# EAGLE design Converter_board (EAGLE 6.6.0)
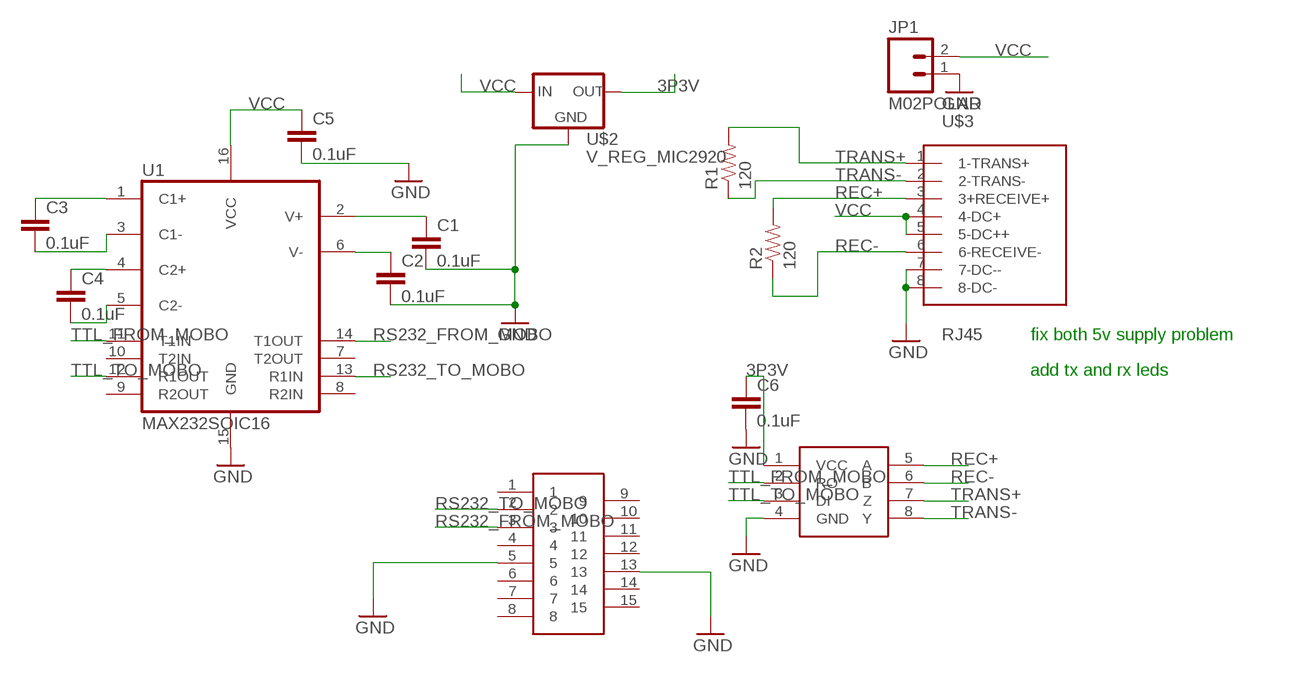
[diagram p0: schematic, sheet 1]

## Parts
C1  0.1uF  CAP1206  [1206]
C2  0.1uF  CAP1206  [1206]
C3  0.1uF  CAP1206  [1206]
C4  0.1uF  CAP1206  [1206]
C5  0.1uF  CAP1206  [1206]
C6  0.1uF  CAP1206  [1206]
JP1  M02POLAR  [MOLEX-1X2]
R1  120  RESISTOR1206  [1206]
R2  120  RESISTOR1206  [1206]
U1  MAX232SOIC16  [SO016]
U$1  MAX3077ESA  [SOIC8]
U$2  V_REG_MIC2920  [SOT223]
U$3  RJ45  [RJ45-CAT5E]
U$4  DB15  [DB15]

## Nets
3P3V: C6.1 U$1.1(VCC) U$2.3(OUT)
GND: C1.2 C2.2 C5.2 C6.2 JP1.1 U1.15(GND) U$1.4(GND) U$2.2(GND) U$3.7(7-DC--) U$3.8(8-DC-) U$4.5 U$4.13
N$1: C2.1 U1.6(V-)
N$2: C1.1 U1.2(V+)
N$3: C3.1 U1.1(C1+)
N$4: C3.2 U1.3(C1-)
N$5: C4.1 U1.4(C2+)
N$6: C4.2 U1.5(C2-)
REC+: R2.2 U$1.5(A) U$3.3(3+RECEIVE+)
REC-: R2.1 U$1.6(B) U$3.6(6-RECEIVE-)
RS232_FROM_MOBO: U1.14(T1OUT) U$4.3
RS232_TO_MOBO: U1.13(R1IN) U$4.2
TRANS+: R1.2 U$1.7(Z) U$3.1(1-TRANS+)
TRANS-: R1.1 U$1.8(Y) U$3.2(2-TRANS-)
TTL_FROM_MOBO: U1.11(T1IN) U$1.2(RO)
TTL_TO_MOBO: U1.12(R1OUT) U$1.3(DI)
VCC: C5.1 JP1.2 U1.16(VCC) U$2.1(IN) U$3.4(4-DC+) U$3.5(5-DC++)
Unconnected: U1.7(T2OUT) U1.8(R2IN) U1.9(R2OUT) U1.10(T2IN) U$4.1 U$4.4 U$4.6 U$4.7 U$4.8 U$4.9 U$4.10 U$4.11 U$4.12 U$4.14 U$4.15

## Notes on the sheet
- fix both 5v supply problem
- add tx and rx leds

## Library data of the parts
C1-C6 = SparkFun-Capacitors:CAP: Capacitor Standard 0603 ceramic capacitor, and 0.1" leaded capacitor.
JP1 = SparkFun-Connectors:M02: Standard 2-pin 0.1" header. Use with - straight break away headers ( PRT-00116) - right angle break away headers (PRT-00553) - swiss pins (PRT-00743) - machine pins (PRT-00117) - female headers (PRT-00115) Molex polarized connector foot print use with: PRT-08233 with associated crimp pins and housings. 2.54_SCREWTERM for use with PRT-10571. 3.5mm Screw Terminal footprints for PRT-08084 5mm Screw Terminal footprints for use with PRT-08433
R1 R2 = SparkFun-Passives:RESISTOR: Resistor Basic schematic elements and footprints for 0603, 1206, and PTH resistors.
U1 = SparkFun-DigitalIC:MAX232: RS232 Transceiver Very common IC. This is generically called 'MAX232', but works with the 3V equivalent MAX3232 generic ICs. Field tested and mother approved. Spark Fun Electronics SKU : COM-00316 (DIP) and COM-00589 (SMD)
U$1 = MRDT-LIB2014:MAX3077ESA
U$2 = SparkFun-PowerIC:V_REG_MIC2920: MIC2920A (http://www.micrel.com/_PDF/mic2920.pdf) - 400mA output LDO Regulator
U$3 = MRDT-LIB2014:RJ45
U$4 = MRDT-LIB2014:DB15

## Board
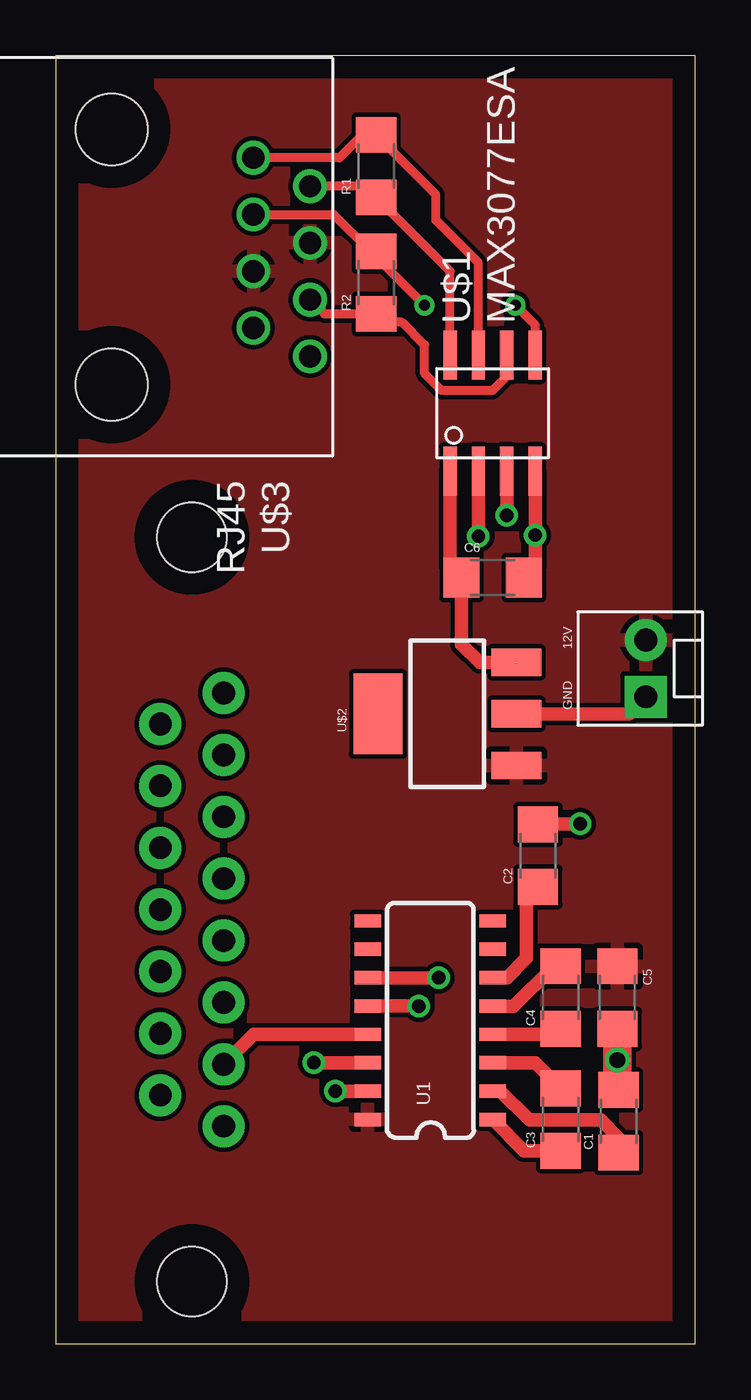
[diagram p1: board, top side]
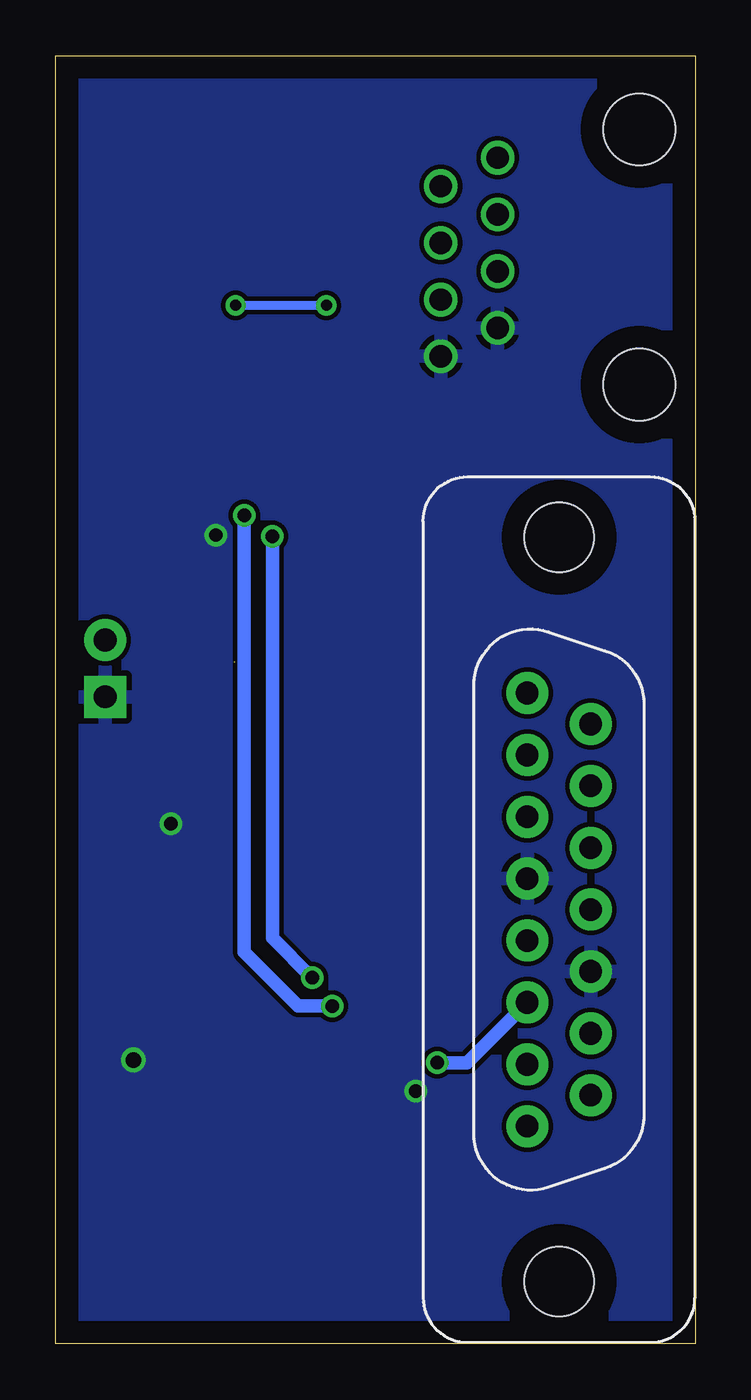
[diagram p2: board, bottom side, seen from below]

Size 28.63 x 57.65 mm. Coordinates in mm from the lower left corner, seen from the top.
Outline: 0,0 28.63,0 28.63,57.65 0,57.65 0,0
Copper layers (1*16): Top 0.035mm / dielectric 1.5mm / Bottom 0.035mm
Design rules "default": minimum track width 10mil, minimum drill 24mil, track to track 8mil, track to pad 8mil, pad to pad 8mil, via to via 8mil, smd to smd 8mil, copper to edge 40mil, drill to drill 8mil, minimum pad ring 10mil, minimum via ring 8mil, stop-mask expansion 4mil, vias tented up to drill 0mil, thermal gap 10mil

### Footprints (pad centres in the part's own frame; a part is rotated, then mirrored left to right if it is on the bottom)
1206 = smd 1.6 x 1.8: 1 -1.4,0; 2 1.4,0
MOLEX-1X2 = drill 1.016 pad 1.88 square: 1 0,0 | drill 1.016 pad 1.88: 2 2.54,0
SO016 = smd 0.6 x 1.2: 1 -4.445,-2.8; 2 -3.175,-2.8; 3 -1.905,-2.8; 4 -0.635,-2.8; 5 0.635,-2.8; 6 1.905,-2.8; 7 3.175,-2.8; 8 4.445,-2.8; 9 4.445,2.8; 10 3.175,2.8; 11 1.905,2.8; 12 0.635,2.8; 13 -0.635,2.8; 14 -1.905,2.8; 15 -3.175,2.8; 16 -4.445,2.8
SOIC8 = smd 2.2 x 0.6: 1 -2.6,1.905; 2 -2.6,0.635; 3 -2.6,-0.635; 4 -2.6,-1.905; 5 2.6,-1.905; 6 2.6,-0.635; 7 2.6,0.635; 8 2.6,1.905
SOT223 = smd 1.219 x 2.235: 1 -2.311,-3.099; 2 0,-3.099; 3 2.311,-3.099 | smd 3.6 x 2.2: 4 0,3.099
RJ45-CAT5E = drill 1: 1 -4.445,4.655; 2 -3.175,7.195; 3 -1.905,4.655; 4 -0.635,7.195; 5 0.635,4.655; 6 1.905,7.195; 7 3.175,4.655; 8 4.445,7.195 | hole 3.2: 5.715,-1.695; -5.715,-1.695
DB15 = drill 1.016 pad 1.88: 1 -9.695,1.42; 2 -6.925,1.42; 3 -4.155,1.42; 4 -1.385,1.42; 5 1.385,1.42; 6 4.155,1.42; 7 6.925,1.42; 8 9.695,1.42; 9 8.31,-1.42; 10 5.54,-1.42; 11 2.77,-1.42; 12 0,-1.42; 13 -2.77,-1.42; 14 -5.54,-1.42; 15 -8.31,-1.42 | hole 3.1: -16.66,0; 16.66,0

### Placement (x,y rotation side)
C1  25.2,9.96 90 top
C2  21.59,21.84 90 top
C3  22.61,10.03 90 top
C4  22.61,15.49 90 top
C5  25.15,15.49 270 top
C6  19.56,34.29 0 top
JP1  26.42,28.96 90 top
R1  14.35,52.71 90 top
R2  14.35,47.5 90 top
U1  16.76,14.48 90 top
U$1  19.56,41.66 90 top
U$2  17.53,28.19 90 top
U$3  4.19,48.64 270 top
U$4  6.1,19.43 90 bottom

### Tracks (layer width: path | path; a pad name or v marks a point on that pad's centre or on a via)
3P3V  (1 unrouted)
  Top 0.61: 20.6,30.48 18.99,30.48 18.16,31.3 C6.1 | C6.1 17.65,34.8 U$1.1
  Top 0.813: C6.1
GND  (via drill 0.6, 0.7)
  Top 0.61: C2.2 21.61,23.27 v23.47,23.27 | 25.29,13.95 C5.2 25.4,14.09 | C6.2 21.46,34.8 v21.46,36.2 U$1.4 | U$2.2 25.65,28.19 JP1.1 | U1.15 v12.51,11.3
  Top 1.27: C1.2 25.15,11.41 v25.15,12.7 C5.2
  Bottom 0.61: v12.51,11.3 12.51,11.37 12.45,11.43
  pour Bottom: -16.26,59.44 -16.26,-8.13 40.89,-8.13 40.89,59.44
N$1
  Top 0.61: U1.6 20.19,16.38 21.08,17.27 21.08,19.94 C2.1
N$2
  Top 0.61: C1.1 25.2,9.22 24.41,10.01 21.21,10.01 19.91,11.3 U1.2
N$3
  Top 0.61: C3.1 20.96,8.63 U1.1
N$4
  Top 0.61: C3.2 21.47,12.57 U1.3
N$5
  Top 0.61: C4.1 22.36,13.84 U1.4
N$6
  Top 0.61: U1.5 19.59,15.09 20.5,15.09 22.3,16.89 C4.2
REC+  (via drill 0.5)
  Top 0.406: U$3.3 12.45,50.55 14.09,48.9 R2.2 | U$1.5 21.46,45.59 v20.57,46.48 | R2.2 | v16.51,46.48 14.35,48.64 R2.2
  Bottom 0.406: v20.57,46.48 v16.51,46.48
REC-
  Top 0.406: U$3.6 12.02,46.1 R2.1 14.73,45.72 15.49,45.72 16.51,44.7 16.51,43.43 17.27,42.67 19.56,42.67 20.19,43.31 U$1.6
RS232_FROM_MOBO  (via drill 0.6)
  Top 0.61: U1.14 v11.56,12.57
  Bottom 0.61: U$4.3 10.22,12.57 v11.56,12.57
RS232_TO_MOBO
  Top 0.61: U1.13 8.85,13.84 U$4.2
TRANS+
  Top 0.406: U$1.7 18.92,48.39 17.02,50.29 17.02,51.44 R1.2 13.72,54.11 12.7,53.09 U$3.1
TRANS-
  Top 0.406: U$1.8 17.65,48 R1.1 13.84,51.82 U$3.2
TTL_FROM_MOBO  (via drill 0.6)
  Top 0.61: U$1.2 v18.92,36.13 | v17.14,16.38 U1.11
  Bottom 0.61: v18.92,36.13 18.92,18.16 v17.14,16.38
TTL_TO_MOBO  (via drill 0.6)
  Top 0.61: U$1.3 v20.19,37.08 | v16.26,15.11 U1.12
  Bottom 0.61: v20.19,37.08 20.19,17.53 17.78,15.11 v16.26,15.11
VCC
  pour Top: -9.91,58.67 33.27,58.67 33.27,-3.56 -9.91,-3.56

### Text on the board
tPlace: GND 12V